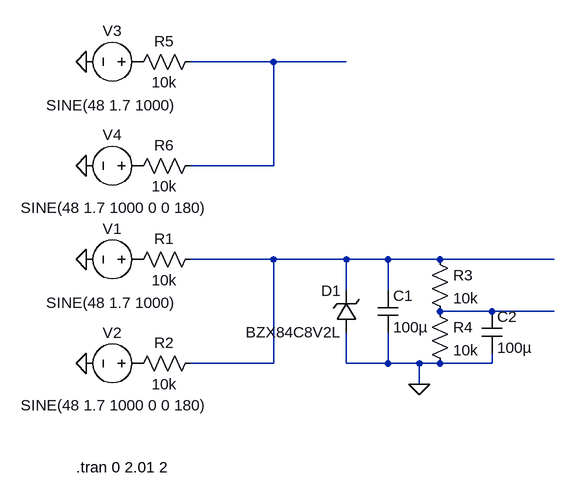
[diagram p0: schematic ExtractorPhantom.asc]
ExtractorPhantom.asc, the LTspice schematic file:
Version 4
SHEET 1 880 680
WIRE 208 -256 80 -256
WIRE 320 -256 208 -256
WIRE 208 -96 208 -256
WIRE 208 -96 80 -96
WIRE 208 48 80 48
WIRE 320 48 208 48
WIRE 384 48 320 48
WIRE 464 48 384 48
WIRE 640 48 464 48
WIRE 320 96 320 48
WIRE 384 96 384 48
WIRE 544 128 464 128
WIRE 640 128 544 128
WIRE 208 208 208 48
WIRE 208 208 80 208
WIRE 320 208 320 160
WIRE 384 208 384 160
WIRE 384 208 320 208
WIRE 432 208 384 208
WIRE 464 208 432 208
WIRE 544 208 544 192
WIRE 544 208 464 208
WIRE 432 240 432 208
FLAG -80 48 0
FLAG -80 208 0
FLAG 432 240 0
FLAG -80 -256 0
FLAG -80 -96 0
SYMBOL res 96 32 R90
WINDOW 0 0 56 VBottom 2
WINDOW 3 32 56 VTop 2
SYMATTR InstName R1
SYMATTR Value 10k
SYMBOL res 96 192 R90
WINDOW 0 0 56 VBottom 2
WINDOW 3 32 56 VTop 2
SYMATTR InstName R2
SYMATTR Value 10k
SYMBOL voltage 16 48 R90
WINDOW 0 -32 56 VBottom 2
WINDOW 3 51 58 VTop 2
WINDOW 123 0 0 Left 0
WINDOW 39 0 0 Left 0
SYMATTR InstName V1
SYMATTR Value SINE(48 1.7 1000)
SYMBOL voltage 16 208 R90
WINDOW 0 -32 56 VBottom 2
WINDOW 3 49 53 VTop 2
WINDOW 123 0 0 Left 0
WINDOW 39 0 0 Left 0
SYMATTR InstName V2
SYMATTR Value SINE(48 1.7 1000 0 0 180)
SYMBOL zener 336 160 R180
WINDOW 0 24 64 Left 2
WINDOW 3 24 0 Left 2
SYMATTR InstName D1
SYMATTR Value BZX84C8V2L
SYMBOL cap 368 96 R0
SYMATTR InstName C1
SYMATTR Value 100µ
SYMBOL res 448 32 R0
SYMATTR InstName R3
SYMATTR Value 10k
SYMBOL res 448 112 R0
SYMATTR InstName R4
SYMATTR Value 10k
SYMBOL cap 528 128 R0
SYMATTR InstName C2
SYMATTR Value 100µ
SYMBOL res 96 -272 R90
WINDOW 0 0 56 VBottom 2
WINDOW 3 32 56 VTop 2
SYMATTR InstName R5
SYMATTR Value 10k
SYMBOL res 96 -112 R90
WINDOW 0 0 56 VBottom 2
WINDOW 3 32 56 VTop 2
SYMATTR InstName R6
SYMATTR Value 10k
SYMBOL voltage 16 -256 R90
WINDOW 0 -32 56 VBottom 2
WINDOW 3 51 58 VTop 2
WINDOW 123 0 0 Left 0
WINDOW 39 0 0 Left 0
SYMATTR InstName V3
SYMATTR Value SINE(48 1.7 1000)
SYMBOL voltage 16 -96 R90
WINDOW 0 -32 56 VBottom 2
WINDOW 3 49 53 VTop 2
WINDOW 123 0 0 Left 0
WINDOW 39 0 0 Left 0
SYMATTR InstName V4
SYMATTR Value SINE(48 1.7 1000 0 0 180)
TEXT -96 368 Left 2 !.tran 0 2.01 2

The netlist it stands for:
* ExtractorPhantom.asc
R1 N002 P001 10k
R2 N002 P002 10k
V1 P001 0 SINE(48 1.7 1000)
V2 P002 0 SINE(48 1.7 1000 0 0 180)
D1 0 N002 BZX84C8V2L
C1 N002 0 100µ
R3 N002 N003 10k
R4 N003 0 10k
C2 N003 0 100µ
R5 N001 P003 10k
R6 N001 P004 10k
V3 P003 0 SINE(48 1.7 1000)
V4 P004 0 SINE(48 1.7 1000 0 0 180)
.model D D
.lib standard.dio
.tran 0 2.01 2
.backanno
.end